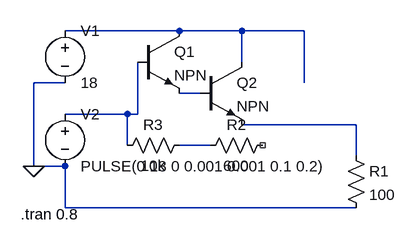
[diagram p0: schematic DarlingtonNPN.asc]
DarlingtonNPN.asc, the LTspice schematic file:
Version 4
SHEET 1 880 680
WIRE -384 -288 -560 -288
WIRE -288 -288 -384 -288
WIRE -192 -288 -288 -288
WIRE -288 -240 -288 -288
WIRE -560 -208 -608 -208
WIRE -192 -208 -192 -288
WIRE -352 -192 -384 -192
WIRE -464 -160 -560 -160
WIRE -448 -160 -448 -240
WIRE -448 -160 -464 -160
WIRE -112 -144 -288 -144
WIRE -464 -112 -464 -160
WIRE -336 -112 -384 -112
WIRE -112 -96 -112 -144
WIRE -608 -80 -608 -208
WIRE -560 -80 -608 -80
WIRE -560 -16 -560 -80
WIRE -112 -16 -560 -16
FLAG -608 -80 0
SYMBOL voltage -560 -304 R0
WINDOW 123 0 0 Left 2
WINDOW 39 0 0 Left 2
SYMATTR InstName V1
SYMATTR Value 18
SYMBOL voltage -560 -176 R0
WINDOW 123 0 0 Left 2
WINDOW 39 0 0 Left 2
SYMATTR InstName V2
SYMATTR Value PULSE(0 18 0 0.001 0.001 0.1 0.2)
SYMBOL res -128 -112 R0
SYMATTR InstName R1
SYMATTR Value 100
SYMBOL npn -448 -288 R0
SYMATTR InstName Q1
SYMBOL npn -352 -240 R0
SYMATTR InstName Q2
SYMBOL res -240 -128 R90
WINDOW 0 0 56 VBottom 2
WINDOW 3 32 56 VTop 2
SYMATTR InstName R2
SYMATTR Value 600
SYMBOL res -368 -128 R90
WINDOW 0 0 56 VBottom 2
WINDOW 3 32 56 VTop 2
SYMATTR InstName R3
SYMATTR Value 10k
TEXT -628 -6 Left 2 !.tran 0.8

The netlist it stands for:
* DarlingtonNPN.asc
V1 N001 0 18
V2 N003 0 PULSE(0 18 0 0.001 0.001 0.1 0.2)
R1 N004 0 100
Q1 N001 N003 N002 0 NPN
Q2 N001 N002 N004 0 NPN
R2 NC_01 N005 600
R3 N005 N003 10k
.model NPN NPN
.model PNP PNP
.lib standard.bjt
.tran 0.8
.backanno
.end